# EAGLE board DAC STM32F446 Board SMD v7 (EAGLE 9.6.2)
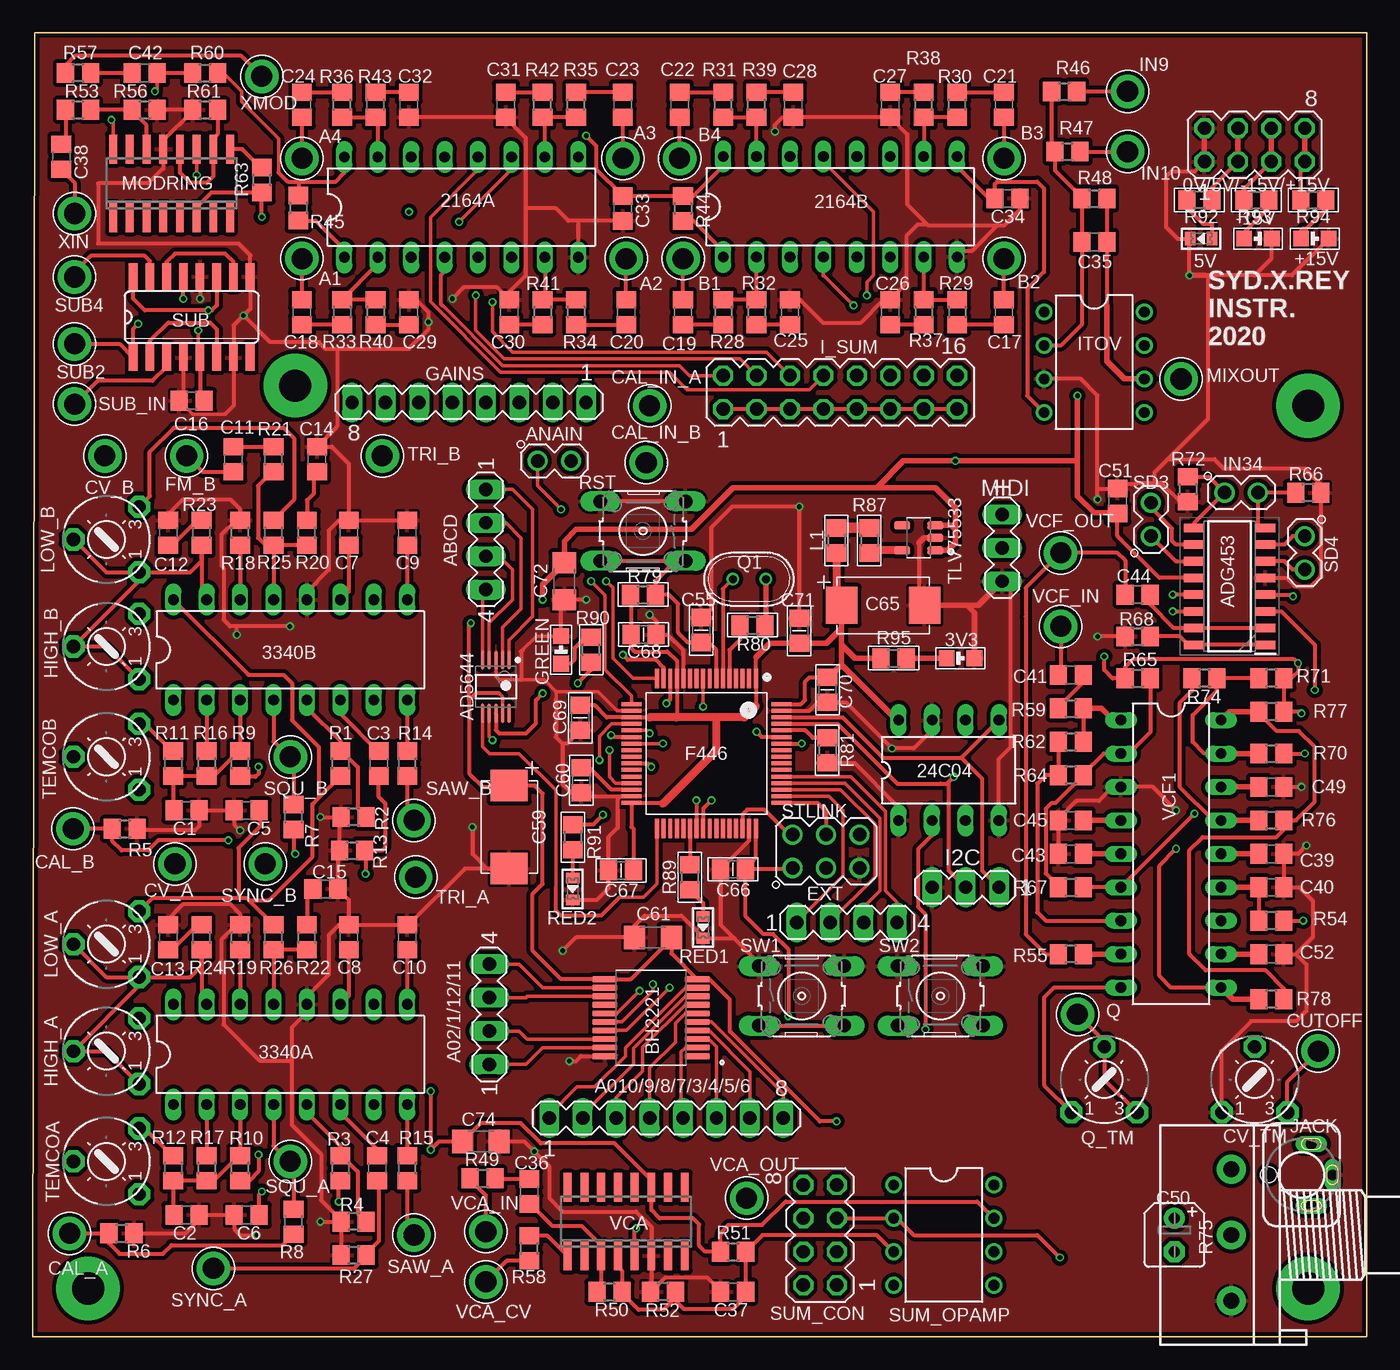
[diagram p5: board, top side]
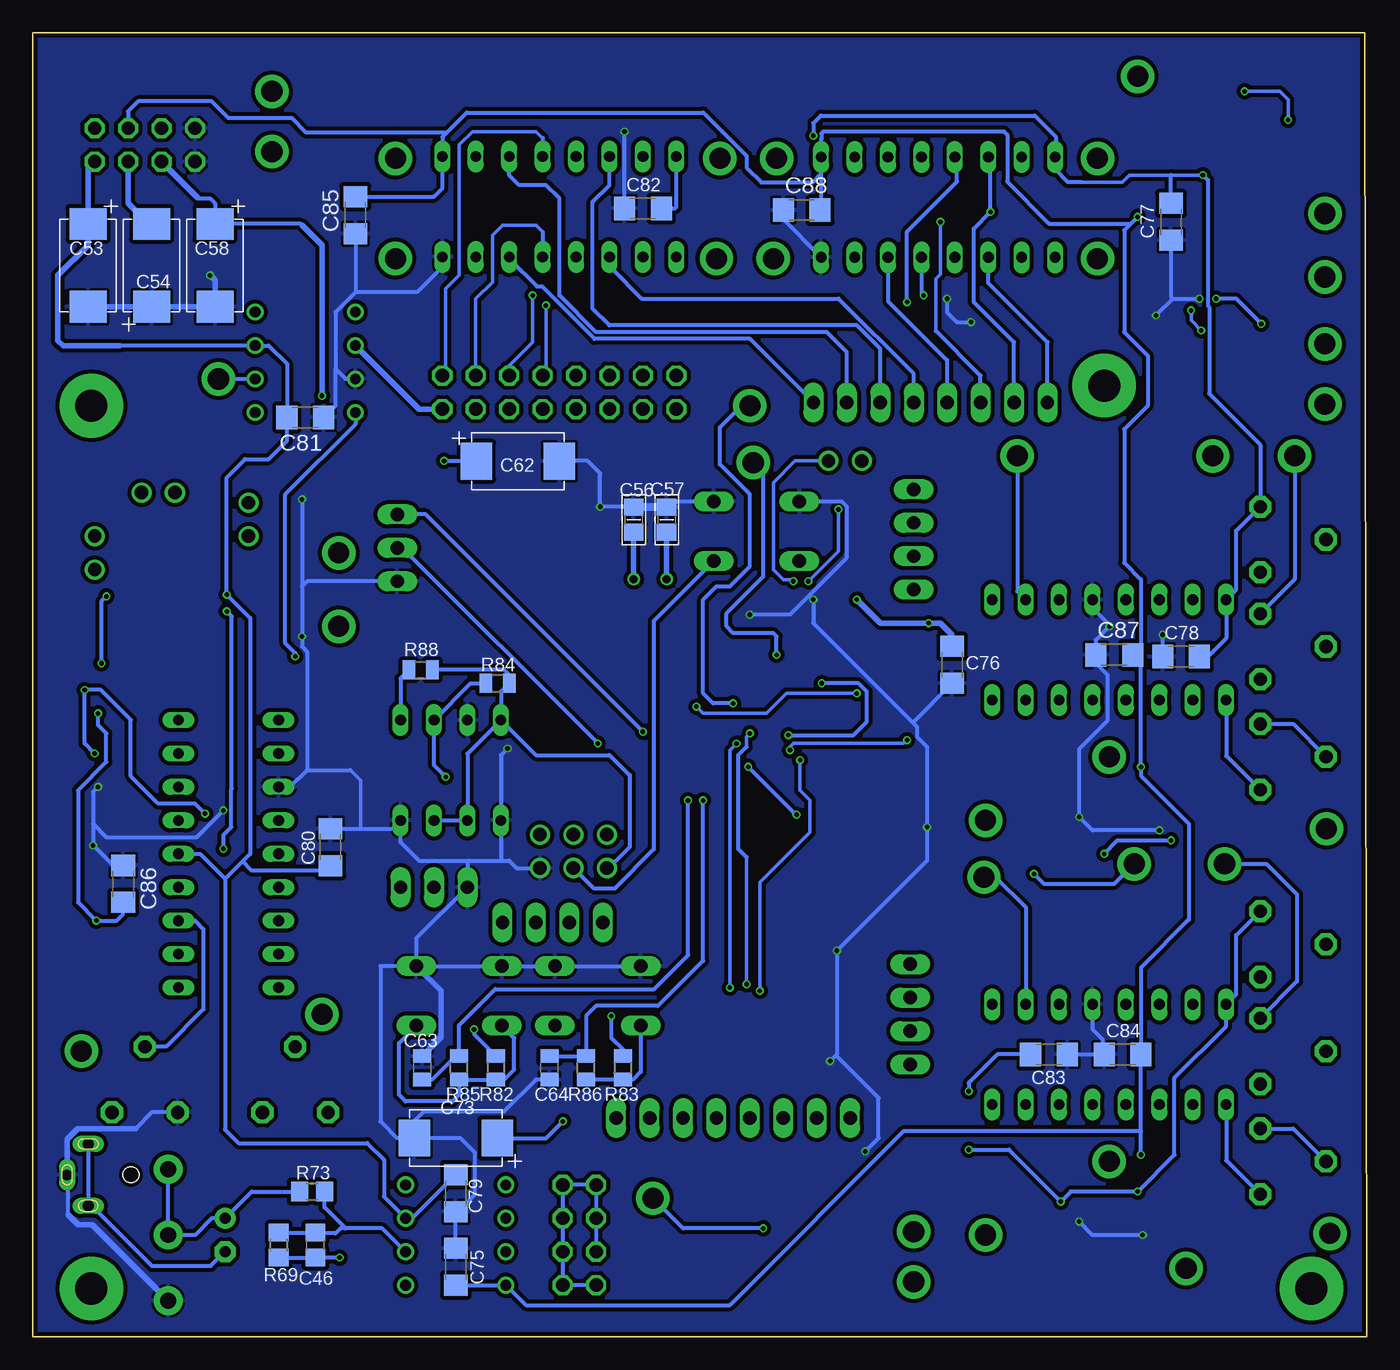
[diagram p6: board, bottom side, seen from below]

Size 101.35 x 99.06 mm. Coordinates in mm from the lower left corner, seen from the top.
Outline: 0,0 101.35,0 101.35,99.06 0.13,99.06 0,0
Copper layers (1*16): Top 0.018mm / dielectric 1.55mm / Bottom 0.018mm
Design rules "eC_2Layer_PClass6_BaseCopperO18_eCDefault": minimum track width 0.15mm, minimum drill 0.35mm, track to track 0.15mm, track to pad 0.15mm, pad to pad 0.15mm, via to via 0.15mm, smd to smd 0mil, copper to edge 0.25mm, drill to drill 0.35mm, minimum pad ring 0.175mm, minimum via ring 0.125mm, stop-mask expansion 0mil, vias tented up to drill 0.45mm, thermal gap 0.2mm

## Footprints (pad centres in the part's own frame; a part is rotated, then mirrored left to right if it is on the bottom)
MA04-2 = drill 1.016 octagon: 1 -3.81,-1.27; 2 -3.81,1.27; 3 -1.27,-1.27; 4 -1.27,1.27; 5 1.27,-1.27; 6 1.27,1.27; 7 3.81,-1.27; 8 3.81,1.27
0805-LED = smd 1.2 x 1.2: A -1.05,0; C 1.05,0
0603-LED = smd 0.8 x 1: A 0.825,0; C -0.825,0
DIL8 = drill 0.813 long: 1 -3.81,-3.81; 2 -1.27,-3.81; 3 1.27,-3.81; 4 3.81,-3.81; 5 3.81,3.81; 6 1.27,3.81; 7 -1.27,3.81; 8 -3.81,3.81
DIL16 = drill 0.813 long: 1 -8.89,-3.81; 2 -6.35,-3.81; 3 -3.81,-3.81; 4 -1.27,-3.81; 5 1.27,-3.81; 6 3.81,-3.81; 7 6.35,-3.81; 8 8.89,-3.81; 9 8.89,3.81; 10 6.35,3.81; 11 3.81,3.81; 12 1.27,3.81; 13 -1.27,3.81; 14 -3.81,3.81; 15 -6.35,3.81; 16 -8.89,3.81
TESTPOINT_63 = drill 1.6 pad 2.54: P$1 0,0
MA04-1 = drill 1.016 long: 1 -3.81,0; 2 -1.27,0; 3 1.27,0; 4 3.81,0
MA08-1 = drill 1.016 long: 1 -8.89,0; 2 -6.35,0; 3 -3.81,0; 4 -1.27,0; 5 1.27,0; 6 3.81,0; 7 6.35,0; 8 8.89,0
ANALOG_DEVICES_AD5644RBRMZ-5_0 = smd 1.45 x 0.25: 1 -2.025,1; 2 -2.025,0.5; 3 -2.025,0; 4 -2.025,-0.5; 5 -2.025,-1; 6 2.025,-1; 7 2.025,-0.5; 8 2.025,0; 9 2.025,0.5; 10 2.025,1
SOIC127P600X175-16N = smd 1.525 x 0.65: 1 -2.712,4.445; 2 -2.712,3.175; 3 -2.712,1.905; 4 -2.712,0.635; 5 -2.712,-0.635; 6 -2.712,-1.905; 7 -2.712,-3.175; 8 -2.712,-4.445; 9 2.712,-4.445; 10 2.712,-3.175; 11 2.712,-1.905; 12 2.712,-0.635; 13 2.712,0.635; 14 2.712,1.905; 15 2.712,3.175; 16 2.712,4.445
MA02-1 = drill 1.016: 1 -2.54,0; 2 0,0
SOP65P780X200-20N = smd 1.9 x 0.48: 1 -3.505,2.925; 2 -3.505,2.275; 3 -3.505,1.625; 4 -3.505,0.975; 5 -3.505,0.325; 6 -3.505,-0.325; 7 -3.505,-0.975; 8 -3.505,-1.625; 9 -3.505,-2.275; 10 -3.505,-2.925; 11 3.505,-2.925; 12 3.505,-2.275; 13 3.505,-1.625; 14 3.505,-0.975; 15 3.505,-0.325; 16 3.505,0.325; 17 3.505,0.975; 18 3.505,1.625; 19 3.505,2.275; 20 3.505,2.925
C0805 = smd 1.3 x 1.5: 1 -0.95,0; 2 0.95,0
B45181A = drill 0.813 pad 1.6: + -1.27,0 | drill 0.813 pad 1.6 octagon: - 1.27,0
CPOL2917 = smd 2.4 x 2.8: + -3.15,0; - 3.15,0
C1206 = smd 1.6 x 1.8: 1 -1.4,0; 2 1.4,0
C0805' = smd 1.016 x 1.422: 1 -0.889,0; 2 0.889,0
6MM = drill 1 pad 1.676 octagon: A -2.5,-2.5; E 2.5,-2.5; S 0,2.5
QFP50P1200X1200X160-64N = smd 1.5 x 0.3: 1 -5.7,3.75; 2 -5.7,3.25; 3 -5.7,2.75; 4 -5.7,2.25; 5 -5.7,1.75; 6 -5.7,1.25; 7 -5.7,0.75; 8 -5.7,0.25; 9 -5.7,-0.25; 10 -5.7,-0.75; 11 -5.7,-1.25; 12 -5.7,-1.75; 13 -5.7,-2.25; 14 -5.7,-2.75; 15 -5.7,-3.25; 16 -5.7,-3.75; 33 5.7,-3.75; 34 5.7,-3.25; 35 5.7,-2.75; 36 5.7,-2.25; 37 5.7,-1.75; 38 5.7,-1.25; 39 5.7,-0.75; 40 5.7,-0.25; 41 5.7,0.25; 42 5.7,0.75; 43 5.7,1.25; 44 5.7,1.75; 45 5.7,2.25; 46 5.7,2.75; 47 5.7,3.25; 48 5.7,3.75 | smd 0.3 x 1.5: 17 -3.75,-5.7; 18 -3.25,-5.7; 19 -2.75,-5.7; 20 -2.25,-5.7; 21 -1.75,-5.7; 22 -1.25,-5.7; 23 -0.75,-5.7; 24 -0.25,-5.7; 25 0.25,-5.7; 26 0.75,-5.7; 27 1.25,-5.7; 28 1.75,-5.7; 29 2.25,-5.7; 30 2.75,-5.7; 31 3.25,-5.7; 32 3.75,-5.7; 49 3.75,5.7; 50 3.25,5.7; 51 2.75,5.7; 52 2.25,5.7; 53 1.75,5.7; 54 1.25,5.7; 55 0.75,5.7; 56 0.25,5.7; 57 -0.25,5.7; 58 -0.75,5.7; 59 -1.25,5.7; 60 -1.75,5.7; 61 -2.25,5.7; 62 -2.75,5.7; 63 -3.25,5.7; 64 -3.75,5.7
HOLES_096-PAD-NS = drill 2.438 pad 4.826: B096 0,0
MA03-1 = drill 1.016 long: 1 -2.54,0; 2 0,0; 3 2.54,0
MA08-2 = drill 1.016 octagon: 1 -8.89,-1.27; 2 -8.89,1.27; 3 -6.35,-1.27; 4 -6.35,1.27; 5 -3.81,-1.27; 6 -3.81,1.27; 7 -1.27,-1.27; 8 -1.27,1.27; 9 1.27,-1.27; 10 1.27,1.27; 11 3.81,-1.27; 12 3.81,1.27; 13 6.35,-1.27; 14 6.35,1.27; 15 8.89,-1.27; 16 8.89,1.27
DIL08 = drill 0.813 pad 1.27: 1 -3.81,-3.81; 2 -1.27,-3.81; 3 1.27,-3.81; 4 3.81,-3.81; 5 3.81,3.81; 6 1.27,3.81; 7 -1.27,3.81; 8 -3.81,3.81
1502_01 = drill 0.8 pad 1.2 long: 1 0,2.35; 2 -2.35,0.75; 3 2.35,0.75 | hole 1.2: 0,-2.5
L0805 = smd 1.3 x 1.5: 1 -0.95,0; 2 0.95,0
SO16 = smd 0.6 x 2.2: 1 -4.445,-2.6; 2 -3.175,-2.6; 3 -1.905,-2.6; 4 -0.635,-2.6; 5 0.635,-2.6; 6 1.905,-2.6; 7 3.175,-2.6; 8 4.445,-2.6; 9 4.445,2.6; 10 3.175,2.6; 11 1.905,2.6; 12 0.635,2.6; 13 -0.635,2.6; 14 -1.905,2.6; 15 -3.175,2.6; 16 -4.445,2.6
Q-HC-46X = drill 0.61: 1 -1.25,0; 2 1.25,0
R0805 = smd 1.3 x 1.5: 1 -0.95,0; 2 0.95,0
3RP/1610N = drill 1.2 pad 2.184: 1 -5,0; 2 0,0; 3 5,0
R0805' = smd 1.016 x 1.422: 1 -0.889,0; 2 0.889,0
B3F-10XX = drill 1.016 long: 1 -3.251,2.261; 2 3.251,2.261; 3 -3.251,-2.261; 4 3.251,-2.261
MA03-2 = drill 1.016: 1 -2.54,-1.27; 2 -2.54,1.27; 3 0,-1.27; 4 0,1.27; 5 2.54,-1.27; 6 2.54,1.27
SO16' = smd 0.66 x 2.032: 1 -4.445,-3.073; 2 -3.175,-3.073; 3 -1.905,-3.073; 4 -0.635,-3.073; 5 0.635,-3.073; 6 1.905,-3.073; 7 3.175,-3.073; 8 4.445,-3.073; 9 4.445,3.073; 10 3.175,3.073; 11 1.905,3.073; 12 0.635,3.073; 13 -0.635,3.073; 14 -1.905,3.073; 15 -3.175,3.073; 16 -4.445,3.073
SOT95P280X145-5N = smd 1.21 x 0.59: 1 -1.255,0.95; 2 -1.255,0; 3 -1.255,-0.95; 4 1.255,-0.95; 5 1.255,0.95
DIL18 = drill 0.813 long: 1 -10.16,-3.81; 2 -7.62,-3.81; 3 -5.08,-3.81; 4 -2.54,-3.81; 5 0,-3.81; 6 2.54,-3.81; 7 5.08,-3.81; 8 7.62,-3.81; 9 10.16,-3.81; 10 10.16,3.81; 11 7.62,3.81; 12 5.08,3.81; 13 2.54,3.81; 14 0,3.81; 15 -2.54,3.81; 16 -5.08,3.81; 17 -7.62,3.81; 18 -10.16,3.81

## Placement (x,y rotation side)
0V/5V/-15V/+15V  [MA04-2]  92.84,90.55 0 top
3V3  [0805-LED]  70.48,51.56 0 top
5V  [0603-LED]  88.77,83.44 0 top
24C04  24C04AP  [DIL8]  69.6,43.05 0 top
2164A  SSM2164  [DIL16]  32.56,85.82 0 top
2164B  SSM2164  [DIL16]  61.34,85.85 0 top
3340A  CEM3340  [DIL16]  19.56,21.46 0 top
3340B  CEM3340  [DIL16]  19.56,52.2 0 top
+15V  [0805-LED]  97.41,83.44 0 top
-15V  [0805-LED]  93.09,83.44 180 top
A1  T  [TESTPOINT_63]  20.45,81.92 0 top
A2  T  [TESTPOINT_63]  45.09,81.92 0 top
A02/1/12/11  [MA04-1]  34.67,24.51 90 top
A3  T  [TESTPOINT_63]  44.83,89.54 0 top
A4  T  [TESTPOINT_63]  20.45,89.54 0 top
A010/9/8/7/3/4/5/6  [MA08-1]  48.13,16.64 0 top
ABCD  [MA04-1]  34.42,60.58 270 top
AD5644  ANALOG_DEVICES_AD5644RBRMZ-5ANALOG_DEVICES_AD5644RBRMZ-5_0_0  [ANALOG_DEVICES_AD5644RBRMZ-5_0]  35.18,49.4 270 top
ADG453  ADG453BRZ  [SOIC127P600X175-16N]  90.93,57.02 180 top
ANAIN  [MA02-1]  40.89,66.55 0 top
B1  T  [TESTPOINT_63]  49.4,81.92 0 top
B2  T  [TESTPOINT_63]  73.79,81.92 0 top
B3  T  [TESTPOINT_63]  73.79,89.54 0 top
B4  T  [TESTPOINT_63]  49.15,89.54 0 top
BH2221  BH2221FV  [SOP65P780X200-20N]  46.96,24.26 180 top
C1  100n  [C0805]  11.68,40 180 top
C2  100n  [C0805]  11.68,9.27 180 top
C3  1n  [C0805]  26.29,43.56 90 top
C4  1n  [C0805]  26.16,12.83 90 top
C5  100n  [C0805]  16.26,40 0 top
C6  100n  [C0805]  16.26,9.27 0 top
C7  1n  [C0805]  24,61.09 270 top
C8  1n  [C0805]  24,30.35 270 top
C9  100n  [C0805]  28.45,61.09 270 top
C10  100n  [C0805]  28.45,30.35 270 top
C11  100n  [C0805]  15.24,66.68 270 top
C12  10n  [C0805]  10.29,61.09 270 top
C13  10n  [C0805]  10.29,30.35 270 top
C14  10n  [C0805]  21.59,66.68 90 top
C15  10n  [C0805]  22.22,34.04 0 top
C16  100n  [C0805]  12.07,71.12 180 top
C17  470n  [C0805]  73.79,77.85 270 top
C18  470n  [C0805]  20.45,77.85 270 top
C19  470n  [C0805]  49.4,77.85 270 top
C20  470n  [C0805]  45.09,77.85 270 top
C21  470n  [C0805]  73.79,93.6 90 top
C22  470n  [C0805]  49.15,93.6 90 top
C23  470n  [C0805]  44.83,93.6 90 top
C24  470n  [C0805]  20.45,93.6 90 top
C25  560p  [C0805]  57.53,77.85 270 top
C26  560p  [C0805]  65.15,77.85 270 top
C27  560p  [C0805]  65.15,93.6 90 top
C28  560p  [C0805]  57.79,93.6 90 top
C29  560p  [C0805]  28.57,77.85 270 top
C30  560p  [C0805]  36.2,77.85 270 top
C31  560p  [C0805]  35.94,93.6 90 top
C32  560p  [C0805]  28.57,93.6 90 top
C33  100n  [C0805]  44.83,85.73 90 top
C34  100n  [C0805]  74.04,86.49 0 top
C35  100p  [C0805]  80.64,83.19 0 top
C36  4.7u  [C0805]  37.72,11.05 90 top
C37  4.7u  [C0805]  53.21,3.43 180 top
C38  4.7u  [C0805]  2.16,89.66 270 top
C39  100n  [C0805]  94.11,36.7 180 top
C40  100n  [C0805]  94.11,34.16 0 top
C41  470n  [C0805]  78.87,50.29 180 top
C42  1u  [C0805]  8.51,96.01 180 top
C43  300p  [C0805]  78.87,36.7 0 top
C44  1u  [C0805]  83.95,56.39 180 top
C45  300p  [C0805]  78.87,39.24 0 top
C46  100p  [C0805]  79.88,6.99 270 bottom
C49  300p  [C0805]  94.11,41.78 180 top
C50  22u  [B45181A]  86.74,7.75 270 top
C51  100n  [C0805]  82.42,63.5 90 top
C52  300p  [C0805]  94.11,29.08 180 top
C53  10u  [CPOL2917]  97.16,81.41 270 bottom
C54  10u  [CPOL2917]  92.33,81.41 90 bottom
C55  0.1uF  [C0805]  50.78,53.7 270 top
C56  12pF  [C0805]  55.69,62.07 270 bottom
C57  12pF  [C0805]  53.19,62.07 270 bottom
C58  10u  [CPOL2917]  87.5,81.41 270 bottom
C59  10u  [CPOL2917]  36.2,38.73 270 top
C60  2.2uF  [C0805]  41.68,42.3 90 top
C61  100n  [C1206]  47.12,30.35 0 top
C62  10u  [CPOL2917]  64.48,66.52 0 bottom
C63  100n  [C0805']  71.75,20.45 90 bottom
C64  100n  [C0805']  62.1,20.45 270 bottom
C65  100 uF  [CPOL2917]  64.61,55.57 0 top
C66  0.1uF  [C0805]  53.2,35.53 0 top
C67  0.1uF  [C0805]  44.69,35.45 0 top
C68  0.1uF  [C0805]  46.4,53.36 180 top
C69  0.1uF  [C0805]  41.6,47.02 90 top
C70  0.1uF  [C0805]  60.38,49.16 90 top
C71  1.0uF  [C0805]  58.24,53.64 270 top
C72  100n  [C1206]  40.39,57.4 90 top
C73  10u  [CPOL2917]  69.21,15.11 180 bottom
C74  1u  [C1206]  34.04,14.86 180 top
C75  1u  [C1206]  69.21,5.33 270 bottom
C76  1u  [C1206]  31.5,51.05 90 bottom
C77  1u  [C1206]  14.86,84.71 90 bottom
C78  1u  [C1206]  14.1,51.69 0 bottom
C79  1u  [C1206]  69.21,10.92 90 bottom
C80  1u  [C1206]  78.74,37.21 270 bottom
C81  1u  [C1206]  80.64,69.85 180 bottom
C82  1u  [C1206]  54.99,85.73 0 bottom
C83  1u  [C1206]  24.13,21.46 180 bottom
C84  1u  [C1206]  18.54,21.46 0 bottom
C85  1u  [C1206]  76.83,85.22 90 bottom
C86  1u  [C1206]  94.49,34.42 270 bottom
C87  1u  [C1206]  19.18,51.82 0 bottom
C88  1u  [C1206]  42.93,85.6 0 bottom
CAL_A  SYNC_IN  [TESTPOINT_63]  2.79,7.87 90 top
CAL_B  CALIB B  [TESTPOINT_63]  3.05,38.61 90 top
CAL_IN_A  [TESTPOINT_63]  46.86,70.74 0 top
CAL_IN_B  [TESTPOINT_63]  46.61,66.42 0 top
CUTOFF  [TESTPOINT_63]  97.66,21.72 0 top
CV_A  CV  [TESTPOINT_63]  10.79,35.94 90 top
CV_B  CV  [TESTPOINT_63]  5.46,66.93 90 top
CV_TM  100k  [6MM]  92.84,19.56 0 top
EXT  [MA04-1]  61.85,31.5 0 top
F446  STM32F446RCT7  [QFP50P1200X1200X160-64N]  51.18,44.32 270 top
FM_B  FMLIN  [TESTPOINT_63]  11.68,66.93 90 top
GAINS  GAIN_CTRL  [MA08-1]  33.15,70.99 180 top
GREEN  [0805-LED]  40.13,52.2 90 top
HIGH_A  100k  [6MM]  5.59,21.72 90 top
HIGH_B  100k  [6MM]  5.59,52.45 90 top
HOLE1  HOLES_MOUNT-PAD-ROUND-0.096-NS  [HOLES_096-PAD-NS]  96.9,70.74 0 top
HOLE2  HOLES_MOUNT-PAD-ROUND-0.096-NS  [HOLES_096-PAD-NS]  4.19,3.68 0 top
HOLE3  HOLES_MOUNT-PAD-ROUND-0.096-NS  [HOLES_096-PAD-NS]  96.9,3.68 0 top
HOLE4  HOLES_MOUNT-PAD-ROUND-0.096-NS  [HOLES_096-PAD-NS]  19.94,72.26 0 top
I2C  [MA03-1]  70.87,34.16 180 top
I_SUM  ITOV  [MA08-2]  61.34,71.76 0 top
IN9  [TESTPOINT_63]  83.19,94.62 0 top
IN10  [TESTPOINT_63]  83.19,90.04 0 top
IN34  IN34  [MA02-1]  93.09,64.14 0 top
ITOV  NE5534AN  [DIL08]  80.64,74.04 270 top
JACK  1502_01  [1502_01]  96.39,12.32 270 top
L1  1 uH  [L0805]  61.06,60.5 270 top
LOW_A  100k  [6MM]  5.59,29.85 90 top
LOW_B  100k  [6MM]  5.59,60.58 90 top
MIDI  [MA03-1]  73.66,59.94 270 top
MIXOUT  [TESTPOINT_63]  87.25,72.77 0 top
MODRING  LM13700M  [SO16]  10.54,87.63 0 top
Q  [TESTPOINT_63]  79.38,24.51 0 top
Q1  16MHz  [Q-HC-46X]  54.44,57.57 180 top
Q_TM  100k  [6MM]  81.41,19.56 0 top
R1  330k  [R0805]  23.37,43.56 270 top
R2  68k  [R0805]  24.38,39.5 180 top
R3  330k  [R0805]  23.37,12.83 270 top
R4  68k  [R0805]  24.38,8.76 180 top
R5  10k  [R0805]  6.98,38.61 0 top
R6  10k  [R0805]  6.73,7.87 0 top
R7  33k  [R0805]  19.81,39.5 90 top
R8  33k  [R0805]  19.81,8.76 90 top
R9  820  [R0805]  15.75,43.56 90 top
R10  820  [R0805]  15.75,12.83 90 top
R11  24k  [R0805]  10.67,43.56 270 top
R12  24k  [R0805]  10.67,12.83 270 top
R13  470k  [R0805]  24.26,36.96 0 top
R14  5.6k  [R0805]  28.45,43.56 90 top
R15  5.6k  [R0805]  28.45,12.83 90 top
R16  5.6k  [R0805]  13.21,43.56 270 top
R17  5.6k  [R0805]  13.21,12.83 270 top
R18  1.8k  [R0805]  15.75,61.09 90 top
R19  1.8k  [R0805]  15.75,30.35 90 top
R20  470  [R0805]  20.83,61.09 90 top
R21  1M  [R0805]  18.29,66.68 90 top
R22  470  [R0805]  20.83,30.35 90 top
R23  470  [R0805]  12.83,61.09 90 top
R24  470  [R0805]  12.83,30.35 90 top
R25  1.5M  [R0805]  18.29,61.09 90 top
R26  1.5M  [R0805]  18.29,30.35 90 top
R27  470k  [R0805]  24.38,6.22 0 top
R28  27k  [R0805]  52.45,77.85 270 top
R29  27k  [R0805]  70.23,77.85 270 top
R30  27k  [R0805]  70.23,93.6 90 top
R31  27k  [R0805]  52.45,93.6 90 top
R32  470  [R0805]  54.99,77.85 270 top
R33  27k  [R0805]  23.49,77.85 270 top
R34  27k  [R0805]  41.28,77.85 270 top
R35  27k  [R0805]  41.28,93.6 90 top
R36  27k  [R0805]  23.49,93.6 90 top
R37  470  [R0805]  67.69,77.85 270 top
R38  470  [R0805]  67.69,93.6 90 top
R39  470  [R0805]  54.99,93.6 90 top
R40  470  [R0805]  26.04,77.85 270 top
R41  470  [R0805]  38.73,77.85 270 top
R42  470  [R0805]  38.73,93.6 90 top
R43  470  [R0805]  26.04,93.6 90 top
R44  8.2k  [R0805]  49.4,85.73 270 top
R45  8.2k  [R0805]  20.18,85.76 270 top
R46  27k  [R0805]  78.36,94.62 0 top
R47  27k  [R0805]  78.61,90.04 0 top
R48  33K  [R0805]  80.64,86.49 0 top
R49  100k  [R0805]  34.16,12.06 0 top
R50  1k  [R0805]  43.82,3.43 0 top
R51  10k  [R0805]  53.21,6.48 0 top
R52  10k  [R0805]  47.88,3.43 180 top
R53  100k  [R0805]  3.43,93.22 0 top
R54  1.5k  [R0805]  94.11,31.62 180 top
R55  51k  [R0805]  78.87,29.08 180 top
R56  1k  [R0805]  8.51,93.22 0 top
R57  4.7k  [R0805]  3.43,96.01 180 top
R58  27k  [R0805]  37.72,6.73 90 top
R59  91k  [R0805]  78.87,47.75 0 top
R60  47k  [R0805]  13.08,96.01 0 top
R61  22k  [R0805]  13.08,93.22 0 top
R62  100k  [R0805]  78.87,45.21 0 top
R63  10k  [R0805]  17.4,87.88 90 top
R64  91k  [R0805]  78.87,42.67 180 top
R65  220k  [R0805]  83.95,50.04 0 top
R66  100k  [R0805]  96.9,64.14 180 top
R67  100k  [R0805]  78.87,34.16 0 top
R68  100k  [R0805]  83.95,53.21 0 top
R69  47k  [R0805]  82.68,6.99 270 bottom
R70  91k  [R0805]  94.11,44.32 0 top
R71  220k  [R0805]  94.11,50.04 180 top
R72  100k  [R0805]  87.76,64.39 270 top
R73  470  [R0805]  80.14,11.05 0 bottom
R74  100k  [R0805]  89.03,50.04 180 top
R75  100kB  [3RP/1610N]  91.06,7.75 90 top
R76  91k  [R0805]  94.11,39.24 180 top
R77  220k  [R0805]  94.11,47.5 180 top
R78  100k  [R0805]  94.11,25.65 180 top
R79  100k  [R0805]  46.36,56.39 0 top
R80  100  [R0805]  54.69,54.07 0 top
R81  10K  [R0805]  60.37,44.57 270 top
R82  10k  [R0805']  66.17,20.45 270 bottom
R83  10k  [R0805']  56.52,20.45 270 bottom
R84  1k  [R0805']  66.04,49.66 0 bottom
R85  10k  [R0805']  68.96,20.45 90 bottom
R86  10k  [R0805']  59.31,20.45 90 bottom
R87  1  [R0805]  63.56,60.5 270 top
R88  1k  [R0805']  71.88,50.67 0 bottom
R89  180  [R0805]  49.91,34.92 270 top
R90  1k  [R0805]  42.42,52.2 90 top
R91  180  [R0805]  41.02,37.97 270 top
R92  470  [R0805]  88.65,86.36 180 top
R93  10k  [R0805]  92.96,86.36 0 top
R94  10k  [R0805]  97.28,86.36 0 top
R95  1k  [R0805]  65.41,51.56 0 top
RED1  [0603-LED]  50.93,31.12 90 top
RED2  [0603-LED]  41.02,34.04 90 top
RST  [B3F-10XX]  46.36,61.21 180 top
SAW_A  S  [TESTPOINT_63]  28.96,7.75 270 top
SAW_B  S  [TESTPOINT_63]  28.96,39.24 270 top
SD3  SD3  [MA02-1]  84.96,63.37 90 top
SD4  SD4  [MA02-1]  96.65,58.29 270 top
SQU_A  P  [TESTPOINT_63]  19.56,13.33 270 top
SQU_B  P  [TESTPOINT_63]  19.56,44.07 270 top
STLINK  75867-331LF  [MA03-2]  60.27,36.89 0 top
SUB  4027D  [SO16']  12.07,77.47 0 top
SUB2  T  [TESTPOINT_63]  3.17,75.44 90 top
SUB4  T  [TESTPOINT_63]  3.17,80.52 90 top
SUB_IN  T  [TESTPOINT_63]  3.17,70.87 90 top
SUM_CON  [MA04-2]  59.82,7.75 90 top
SUM_OPAMP  NE5534AN  [DIL08]  69.21,7.75 270 top
SW1  [B3F-10XX]  58.42,25.91 0 top
SW2  [B3F-10XX]  68.96,25.91 0 top
SYNC_A  SYNC_IN  [TESTPOINT_63]  13.72,5.21 180 top
SYNC_B  SYNC_IN  [TESTPOINT_63]  17.65,35.94 90 top
TEMCOA  10k  [6MM]  5.59,13.33 90 top
TEMCOB  10k  [6MM]  5.59,44.07 90 top
TLV75533  TLV75533PDBVR  [SOT95P280X145-5N]  67.31,60.71 180 top
TRI_A  T  [TESTPOINT_63]  29.08,34.92 180 top
TRI_B  T  [TESTPOINT_63]  26.54,66.93 180 top
VCA  LM13700M  [SO16]  45.09,8.76 0 top
VCA_CV  [TESTPOINT_63]  34.42,4.19 0 top
VCA_IN  [TESTPOINT_63]  34.42,8 0 top
VCA_OUT  [TESTPOINT_63]  54.23,10.54 0 top
VCF1  AS3320  [DIL18]  86.49,36.7 270 top
VCF_IN  [TESTPOINT_63]  78.1,53.97 0 top
VCF_OUT  [TESTPOINT_63]  78.1,59.56 0 top
XIN  [TESTPOINT_63]  3.17,85.34 0 top
XMOD  [TESTPOINT_63]  17.4,95.76 0 top

## Tracks (layer width: path | path; a pad name or v marks a point on that pad's centre or on a via)
3V3  (via drill 0.35)
  Top 0.305: 54.93,47.92 F446.1 54.93,51.63 | F446.64 58.36,48.07 58.67,48.39 58.67,49.78 59,50.11 C70.2 60.48,50.11 | R79.1 45.45,56.34 C68.2 45.45,52.34 45.72,52.07 48.22,52.07 48.93,51.36 F446.13 48.93,47.1 48.9,47.07 | F446.32 | C66.2 54.15,35.63 54.93,36.4 F446.48 | C69.2 42.7,47.97 43.61,47.07 F446.19 46.86,47.07 | 61.46,51.09 61.45,51.08 | STLINK.1 57.64,35.53 C66.2 | v57.4,24.38 57.4,29.46 56.25,30.61 55.5,30.61 54.15,31.95 C66.2 | F446.32 47.82,40.57 47.88,40.51 | C67.2 45.64,38.59 45.48,38.75 F446.32 | 24C04.2 68.33,38.1 67.26,37.04 67.26,32.69 67.82,32.13 v67.82,23.37 | C65.+ 61.46,53.84
  Top 0.406: 54.93,51.63 55.99,52.69 C71.2 60.31,52.69 61.46,53.84 | C65.+ 61.46,52.58 | 61.46,52.58 61.46,51.09 | 60.48,50.11 61.45,51.08 65.66,46.86 24C04.8 | R95.1 62.47,51.56 61.46,52.58
  Top 0.61: 54.93,47.92 54.07,47.07 51.94,47.07 | 51.94,47.07 48.9,47.07 46.86,47.07 | L1.2 61.06,55.97 C65.+ | 51.94,47.07 51.94,44.58 47.88,40.51
  Bottom 0.305: 24C04.8 65.79,49.02 R84.2 65.15,50.29 65.53,50.67 R88.2 | 24C04.8 68.33,44.32 24C04.2 24C04.3 | v57.4,24.38 57.4,22.73 56.52,21.84 R83.1 | v67.82,23.37 67.82,22.99 R82.1 | STLINK.1 57.59,35.62 56.01,37.21 56.01,42.67 57.53,44.2 63.12,44.2 24C04.8
5V  (via drill 0.35)
  Top 0.254: AD5644.9 35.68,48.65 35.43,48.89
  Top 0.305: 35.43,48.89 33.66,48.89 33.15,48.39 | 33.15,48.39 33.15,42.8 34.16,41.78 36.09,41.78 C59.+ 38.12,41.88 38.73,41.27 38.73,34.42 37.97,33.65 37.97,29.34 40.13,27.18 BH2221.11 45.45,27.18 48.52,30.25 C61.2 48.52,29.14 BH2221.10 51.4,27.18 52.96,25.62 52.96,23.22 59.8,16.38 v61.07,16.38 | ADG453.12 85.6,57.66 82.42,60.83 C51.1 82.36,62.61 | 33.15,48.39 33.15,54.1 v33.27,54.23 | R92.1 89.6,87.31 0V/5V/-15V/+15V.3
  Top 0.406: TLV75533.3 69.79,61.66 70.1,61.34 | 70.1,61.34 70.1,60.32 69.53,59.76 TLV75533.1 | 82.36,62.61 80.64,62.61 79.38,63.88 79.38,66.55 | 0V/5V/-15V/+15V.4 0V/5V/-15V/+15V.3 | 79.38,66.55 v79.38,71.5 | v38.73,56.01 38.73,57.15 C72.2 40.39,60.45 41.28,61.34 50.04,61.34 53.21,64.52 64.13,64.52 | 70.1,61.34 70.1,62.99 68.58,64.52 64.13,64.52 | 64.13,64.52 66.17,66.55 v70.1,66.55 79.38,66.55
  Bottom 0.305: C73.+ 62.34,15.11 v61.07,16.38 | C62.+ 70.07,66.52 v70.1,66.55 | 80.9,84.45 81,84.56 C58.+ 87.5,86.11 87.88,86.49 88.77,86.49 88.84,86.55
  Bottom 0.406: 80.9,84.45 79.38,82.93 v79.38,71.5 | v38.73,56.01 36.96,54.23 v33.27,54.23 32.39,54.23 31.5,53.34 C76.2 | 0V/5V/-15V/+15V.3 88.84,86.55
2164_IN1_MIXA
  Top 0.305: R40.1 R33.1 26.21,81.51 2164A.2
2164_IN2_MIXA
  Top 0.305: R34.1 R41.1 38.91,78.97 2164A.7
2164_IN2_MIXB
  Top 0.305: R29.1 R37.1 2164B.7
2164_IN3_MIXA
  Top 0.305: R35.1 R42.1 38.91,92.48 2164A.10
2164_IN3_MIXB
  Top 0.305: R30.1 R38.1 2164B.10
2164_IN4_MIXA
  Top 0.305: R36.1 R43.1 26.21,92.48 2164A.15
2164_IN4_MIXB
  Top 0.305: R31.1 R39.1 2164B.15
2164_IN4_MIXB1
  Top 0.305: R28.1 R32.1 2164B.2
2164_MODE_MIXB
  Top 0.305: R44.2 50.2,84.78 52.45,82.53 2164B.1
2164_OUT2_MIXA  (via drill 0.35)
  Top 0.254: I_SUM.4 53.72,74.3 35.82,74.3 33.66,76.46 v33.66,79.12
  Bottom 0.305: 2164A.5 33.83,79.29 v33.66,79.12
2164_OUT2_MIXB
  Bottom 0.254: I_SUM.14 67.69,78.87 66.42,80.14 66.42,83.69 65.66,84.45 63.12,84.45 62.61,83.95
  Bottom 0.305: 62.61,83.95 2164B.5
2164_OUT3_MIXA
  Top 0.254: 33.66,88.52 30.2,85.07 30.2,78.63 35.55,73.28 48.39,73.28 49.71,71.96 59.01,71.96 I_SUM.8
  Top 0.305: 2164A.12 33.83,88.69 33.66,88.52
2164_OUT3_MIXB
  Bottom 0.254: I_SUM.16 69.98,73.28 69.98,79.63 68.96,80.65 68.96,90.55 67.94,91.57 63.12,91.57 62.61,91.06
  Bottom 0.305: 62.61,91.06 2164B.12
2164_OUT4_MIXA  (via drill 0.35)
  Top 0.254: I_SUM.6 55.75,74.8 36.47,74.8 34.93,76.34 v34.93,78.61
  Bottom 0.305: v34.93,78.61 34.93,83.95 31.11,87.76 31.11,89.46 2164A.13
2164_OUT4_MIXB  (via drill 0.35)
  Top 0.254: v63.37,79.12 63.37,80.14 63.88,80.65 63.88,85.47 60.07,89.28
  Top 0.305: 2164B.13 60.07,89.28
  Bottom 0.254: I_SUM.12 65.15,73.79 63.37,75.56 v63.37,79.12
+15V  (via drill 0.35)
  Top 0.254: R60.2 14.48,96.01 15.85,94.64 15.85,93.85 18.67,91.03 18.67,88.45 | MODRING.11 v12.45,88.27
  Top 0.305: ADG453.13 v86.61,56.39 | LOW_B.E 8.89,63.88 8.89,67.25 10.73,69.09 19.04,69.09 19.85,68.27 19.85,63.6 R25.2 | LOW_A.E 9.09,33.35 15.62,33.35 | 15.62,33.35 16.24,33.35 16.41,33.18 | 16.41,33.18 R26.2 | v42.04,91.25 42.8,90.48 42.8,88.71 C33.2 R44.1 50.2,86.68 52.45,88.93 2164B.16 | SUM_OPAMP.7 71.75,10.29 57.19,10.29 55.41,8.51 52.87,8.51 52.28,7.91 52.26,7.73 R51.1 51.08,6.48 50.62,6.93 50.62,8.56 50.16,9.02 47.62,9.02 46.99,9.65 VCA.11 46.86,11.49 46.86,12.05 44.21,14.7 38.61,14.7 37.07,16.24 34.02,16.24 C74.2 30.86,14.86 v30.23,14.22 v30.23,18.67 | 21.75,40.99 21.24,40.48 21.24,36.48 17.94,33.18 16.41,33.18 | 21.75,40.99 R1.2 | C5.2 17.26,39.95 17.26,38.78 15.62,37.15 15.62,33.35 | 21.75,40.99 21.75,44.8 19.68,46.86 19.68,49.66 19.05,50.29 16.38,50.29 3340B.16 | C6.2 17.21,10.86 v17.4,11.05 | v23.24,10.29 23.24,11.75 R3.2 | 18.67,88.45 19.36,87.76 20.19,87.76 | 2164A.16 23.67,88.44 22.99,87.76 20.19,87.76 | 20.19,87.76 20.19,86.72 R45.1 | R94.1 96.33,88.97 0V/5V/-15V/+15V.7
  Top 0.406: C39.2 VCF1.14 | 0V/5V/-15V/+15V.8 0V/5V/-15V/+15V.7
  Bottom 0.254: v12.45,88.27 14.86,88.27 18.03,88.27 18.56,87.73 21.69,87.73
  Bottom 0.305: VCF1.14 88.65,36.7 86.74,34.8 | 85.41,36.13 84.84,36.7 84.84,54.61 v86.61,56.39 86.61,65.28 85.22,66.68 83.44,66.68 82.05,68.07 C81.2 82.05,73.92 83.44,75.31 ITOV.7 94.74,75.31 | 85.41,36.13 86.74,34.8 | LOW_A.E 9.91,30.53 9.91,26.04 3340A.16 10.67,23.62 14.61,19.69 14.61,13.84 v17.4,11.05 22.48,11.05 v23.24,10.29 27.18,14.22 v30.23,14.22 | v42.04,91.25 42.04,92.21 41.46,92.78 25.22,92.78 23.62,91.19 23.62,89.68 2164A.16 23.67,88.69 22.71,87.73 21.69,87.73 | 97.16,88.77 0V/5V/-15V/+15V.7 | v12.45,88.27 12.07,87.88 12.07,78.32 11.97,78.23 11.97,71.66 8.09,67.78 LOW_B.E 9.91,61.26 9.91,56.77 3340B.16 10.67,53.09 12.07,51.69 C78.2 | C77.2 14.86,88.27 | C79.2 72.52,9.02 SUM_OPAMP.7 74.68,10.67 74.68,13.46 75.95,14.73 85.72,14.73 86.74,15.75 86.74,34.8 | C80.2 79.12,35.43 84.71,35.43 85.41,36.13 | C82.2 52.58,85.73 52.45,85.85 2164B.16 | C83.2 28.07,21.46 30.23,19.3 v30.23,18.67
  Bottom 0.406: 97.16,88.77 C53.+ 97.16,82.93 99.44,80.65 99.44,75.69 99.06,75.31 94.74,75.31
-15V  (via drill 0.35)
  Top 0.305: R54.1 v96.52,31.62 | v96.39,47.37 96.27,47.5 R77.1 R71.1 95.06,50.14 95.73,50.14 96.14,50.55 v96.14,51.18 95.85,51.47 83.57,51.47 83,50.9 R65.1 82.04,50.04 81.41,50.67 v81.41,51.69 | ADG453.4 95.63,56.39 v95.76,56.26 | MODRING.6 12.45,85.83 13.55,86.93 R63.1 v17.4,85.09 | v17.14,43.31 17.14,42.8 16.89,42.54 15.81,42.54 R9.1 | v17.14,13.84 17.14,12.57 16.38,11.81 15.81,11.81 R10.1 | ITOV.4 75.56,71.5 75.56,79.63 76.83,80.9 76.83,87.25 76.33,87.76 73.28,87.76 73.09,87.57 C34.1 72.54,86.61 70.23,88.93 2164B.9 | R93.1 92.01,87.19 0V/5V/-15V/+15V.5
  Top 0.406: 0V/5V/-15V/+15V.6 0V/5V/-15V/+15V.5
  Bottom 0.305: v96.39,47.37 96.39,46.48 95.76,45.85 95.76,43.69 97.92,41.53 97.92,33.02 v96.52,31.62 95,31.62 94.49,32.13 C86.2 | v95.76,56.26 96.14,55.88 v96.14,51.18 | 69.9,91.49 70.23,91.16 2164B.9 70.23,87.25 70.86,86.62 C85.2 | 69.9,91.49 68.38,93.01 50.4,93.01 47.12,89.73 47.12,88.84 45.99,87.71 42.09,87.71 41.45,88.35 2164A.9 | 17.91,84.58 24.13,84.58 27.3,87.76 27.3,91.31 27.56,91.57 41.28,91.57 41.44,91.41 41.44,91 41.45,90.99 2164A.9 | v17.4,85.09 17.91,84.58 | 17.91,84.58 18.41,84.07 18.41,76.33 16.64,74.55 16.64,70.74 18.41,68.96 18.41,58.8 17.14,57.53 17.14,52.45 C87.2 17.14,51.18 v17.14,43.31 17.14,42.63 13.5,38.98 13.5,31.72 17.14,28.07 C84.2 | v17.14,13.84 17.14,15.62 | 17.14,15.62 35.18,15.62 48.39,2.41 63.88,2.41 SUM_OPAMP.4 C75.2 | v81.41,51.69 81.41,51.94 82.17,52.7 82.17,64.01 76.83,69.34 ITOV.4 | 69.9,91.49 80.57,91.49 81.66,92.58 86.49,92.58 87.76,93.85 93.34,93.85 94.11,93.09 0V/5V/-15V/+15V.6 | C84.2 | 17.14,15.62 C84.2 | 2164A.9 41.45,85.68 C88.2
  Bottom 0.406: C54.- 92.53,84.56 94.11,86.14 0V/5V/-15V/+15V.5
AD5644_CLK  (via drill 0.35)
  Top 0.254: AD5644.7 34.68,45.59 v34.93,45.34 | v43.82,44.58 43.82,42.54 44.29,42.07 F446.29
  Bottom 0.254: v34.93,45.34 35.18,45.09 43.56,45.09 43.82,44.83 v43.82,44.58
AD5644_DI  (via drill 0.35)
  Top 0.254: v50.93,47.88 F446.9
  Top 0.305: AD5644.8 35.18,46.1 35.43,45.85 37.47,45.85 38.23,46.61 38.23,48.39 v38.73,48.89
  Bottom 0.254: v38.73,48.89 41.28,48.89 44.07,48.89 45.59,47.37 50.42,47.37 v50.93,47.88
AD5644_SYNC
  Top 0.254: F446.33 47.43,34.42 46.41,33.4 44.58,33.4 | AD5644.6 34.18,44.83 34.69,44.32 36.96,44.32 39.75,41.53 39.75,34.16
  Top 0.305: 44.58,33.4 43.18,32 40.13,32 39.75,32.38 39.75,34.16
BH2221_AO1
  Top 0.254: BH2221.18 37.57,22.63 36.96,23.24 A02/1/12/11.2
BH2221_AO2
  Top 0.254: BH2221.19 38.75,21.98 37.47,20.7 A02/1/12/11.1
BH2221_AO3
  Top 0.254: A010/9/8/7/3/4/5/6.5 49.4,16.89 49.24,17.05 49.24,21.65 49.57,21.98 BH2221.2
BH2221_AO4
  Top 0.254: BH2221.3 51.37,22.63 51.94,22.05 A010/9/8/7/3/4/5/6.6
BH2221_AO6
  Top 0.254: BH2221.5 51.56,23.93 57.02,18.47 A010/9/8/7/3/4/5/6.8
BH2221_AO7
  Top 0.254: BH2221.6 49.57,24.58 48.82,23.83 48.82,22.4 46.86,20.45 A010/9/8/7/3/4/5/6.4
BH2221_AO8
  Top 0.254: BH2221.7 49.57,25.23 46.33,21.99 46.33,20.17 44.32,18.16 A010/9/8/7/3/4/5/6.3
BH2221_AO9
  Top 0.254: BH2221.8 49.57,25.88 45.63,21.94 45.63,20.73 41.78,16.89 A010/9/8/7/3/4/5/6.2
BH2221_AO10
  Top 0.254: BH2221.9 49.57,26.53 45.02,21.98 45.02,21.34 42.68,19.01 41.36,19.01 39.24,16.89 A010/9/8/7/3/4/5/6.1
BH2221_AO11
  Top 0.254: BH2221.12 38.75,26.53 36.96,28.32 A02/1/12/11.4
BH2221_AO12
  Top 0.254: BH2221.13 37.57,25.88 37.47,25.78 A02/1/12/11.3
BH2221_CLK  (via drill 0.35)
  Top 0.254: BH2221.16 44.76,23.93 47.12,26.29 v47.12,26.8 | v46.86,45.85 46.64,46.07 F446.21
  Bottom 0.254: v46.86,45.85 47.12,45.59 47.12,44.83 | 47.12,36.45 v47.12,26.8
  Bottom 0.305: 47.12,44.83 47.75,44.2 47.75,37.08 47.12,36.45
BH2221_DI  (via drill 0.35)
  Top 0.254: BH2221.17 45.13,23.28 v48.39,26.54 | v47.88,45.09 v47.87,45.07 F446.23
  Bottom 0.254: v47.88,45.09 48.39,44.58 v48.39,26.54
BH2221_LD  (via drill 0.35)
  Top 0.254: BH2221.15 44.39,24.58 v46.1,26.29 | F446.20 43.98,46.57 43.05,45.65 v43.05,43.81
  Bottom 0.254: v43.05,43.81 43.05,41.53 42.29,40.77 42.29,38.35 46.1,34.54 v46.1,26.29
BIAS_VCA
  Top 0.305: 48.73,2.87 49.48,2.12 53.21,2.12 54.06,2.97 C37.1 R51.2 55.43,7.75 64.13,7.75 SUM_OPAMP.3 | R52.1 48.73,3.38 48.98,3.12 48.73,2.87 | 48.73,2.87 47.93,2.07 46.03,2.07 44.77,3.33 R50.2 44.77,5.05 44.45,5.36 VCA.4
BOOT1
  Top 0.305: R81.1 59.26,45.52 58.7,46.07 F446.60
CALIB_3340A
  Top 0.305: CAL_A.P$1 R6.1 5.78,7.11 6.58,6.31 9.87,6.31 10.54,6.99 18.98,6.99 R8.1
CALIB_3340B  (via drill 0.35)
  Top 0.305: CAL_B.P$1 R5.1 6.04,37.65 6.73,36.96 8.76,36.96 9.53,37.72 v14.86,37.72 | R7.1 19.81,36.83 v19.94,36.7
  Bottom 0.305: v19.94,36.7 18.92,37.72 v14.86,37.72
CALIB_IN_3340A  (via drill 0.35)
  Top 0.305: F446.14 48.43,48.43 v48.13,48.13
  Bottom 0.305: v48.13,48.13 49.66,48.13 50.42,48.89 50.42,56.01 49.4,57.02 48.39,57.02 46.86,58.55 46.86,64.01 49.15,66.29 49.15,69.09 47.5,70.74 CAL_IN_A.P$1
CALIB_IN_3340B  (via drill 0.35)
  Top 0.305: v44.83,51.82 45.21,51.43 47.35,51.43 47.93,50.85 F446.15
  Bottom 0.305: v44.83,51.82 44.83,53.21 45.09,53.47 48.13,53.47 48.64,53.97 48.64,54.99 45.85,57.78 45.85,65.66 CAL_IN_B.P$1
CAP1_VCF
  Top 0.406: VCF1.5 C43.2
CAP2_VCF
  Top 0.406: VCF1.4 C45.2
CAP3_VCF
  Top 0.406: C49.2 VCF1.16
CAP4_VCF
  Top 0.406: VCF1.11 C52.2
CV_CUTOFF
  Top 0.305: CV_TM.E 95.34,19.39 CUTOFF.P$1
CV_FREQ_3340A
  Bottom 0.305: CV_A.P$1 7.62,35.94 5.29,33.61 5.29,27.01 HIGH_A.E
CV_FREQ_3340B
  Bottom 0.305: CV_B.P$1 5.46,57.58 HIGH_B.E
CV_PWM_3340A
  Top 0.305: 3340A.5 20.83,17.04 23.37,14.5 R3.1 23.47,13.78 24.68,12.56 24.68,9.41 R4.1
CV_PWM_3340B
  Top 0.305: 3340B.5 20.83,47.78 23.37,45.24 R1.1 23.47,44.51 24.68,43.29 24.68,40.15 R2.1
CV_RES
  Top 0.305: Q_TM.E 81.41,19.56 Q_TM.S 81.41,22.48 Q.P$1
CV_VCA
  Top 0.305: R58.1 36.01,5.78 VCA_CV.P$1
EXT1
  Top 0.254: F446.50 60.5,41.07 61.57,40 61.57,35.02 EXT.1
EXT2
  Top 0.254: EXT.2 60.58,31.54 63.98,34.94 63.98,38.98 61.38,41.57 F446.51
EXT3
  Top 0.254: EXT.3 63.12,32.64 64.38,33.9 64.38,39.4 61.71,42.07 F446.52
EXT4
  Top 0.254: F446.53 62.16,42.57 64.79,39.95 64.79,33.89 65.66,33.02 EXT.4
FEEDBACK_VCF
  Top 0.305: C44.1 84.9,55.65 86.7,53.85 ADG453.15 ADG453.2
FMLIN_3340B
  Top 0.305: FM_B.P$1 12.89,65.73 C11.2
FREQ_CTRL_3340A
  Top 0.305: 3340A.15 12.83,25.65 R24.1 12.83,28.23 11.94,27.35 LOW_A.A | LOW_A.A 8.09,26.72 HIGH_A.S 5.59,21.72 HIGH_A.A | LOW_A.S 5.59,27.35 LOW_A.A
FREQ_CTRL_3340B
  Top 0.305: 3340B.15 12.83,56.39 R23.1 12.83,58.97 11.94,58.08 LOW_B.A | LOW_B.A 8.09,57.45 HIGH_B.S 5.59,52.45 HIGH_B.A | LOW_B.S 5.59,58.08 LOW_B.A
FREQ_CV_VCF
  Bottom 0.305: VCF1.12 89.03,31.62 88.39,30.99 88.39,24.89 91.23,22.06 CV_TM.S
GAIN1_A
  Bottom 0.305: GAINS.8 24.26,75.56 28.75,80.05 2164A.3
GAIN1_B
  Bottom 0.305: GAINS.4 34.42,73.16 40.12,78.87 55.09,78.87 57.39,81.17 57.53,81.31 2164B.3
GAIN2_A
  Bottom 0.305: GAINS.5 31.88,74.2 36.37,78.69 2164A.6
GAIN2_B
  Bottom 0.305: GAINS.1 46.86,75.82 58.68,75.82 62.67,79.81 63.05,79.81 65.15,81.92 2164B.6
GAIN3_A  (via drill 0.35)
  Top 0.254: 36.2,88.52 v32.39,84.71
  Top 0.305: 2164A.11 36.37,88.69 36.2,88.52
  Bottom 0.254: v32.39,84.71 32.39,80.73 32.73,80.39 32.73,76.42
  Bottom 0.305: GAINS.6 29.34,73.03 32.73,76.42
GAIN3_B
  Bottom 0.305: GAINS.2 39.5,74.8 41.02,76.33 58.55,76.33 61.34,79.12 61.34,86.49 62.36,87.5 64.39,87.5 65.15,88.27 2164B.11
GAIN4_A  (via drill 0.35)
  Bottom 0.305: GAINS.7 26.8,75.56 29.84,78.61 29.84,84.2 v28.57,85.47 28.57,89.46 2164A.14
GAIN4_B
  Bottom 0.305: GAINS.3 36.96,75.06 38.73,76.84 57.53,76.84 58.8,78.11 58.8,86.23 57.53,87.5 2164B.14
GND  (via drill 0.35)
  Top 0.254: AD5644.3 35.18,50.16 35.43,49.91 37.08,49.91 38.86,49.91 39.75,49.02 | F446.18 44.38,47.57 42.93,49.02 39.75,49.02 | 39.75,49.02 39.75,48.39 | 37.21,52.2 38.26,53.25 GREEN.C | 14.61,70.09 12.14,70.09 C16.2
  Top 0.305: C43.1 C45.1 77.92,39.34 79.3,40.73 81.01,40.73 82.07,41.78 VCF1.3 85.09,41.78 v86.87,40 | C52.1 95.97,29.08 | 95.97,29.08 97.28,30.39 97.28,33.11 96.23,34.16 C40.2 C39.1 96.14,36.7 v96.77,37.34 | 95.97,29.08 96.77,28.29 96.77,24.77 96.01,24 92.58,24 90.3,21.72 90.3,17.1 CV_TM.A | C49.1 v96.39,41.78 | R68.1 v80.9,53.21 | F446.63 59,47.57 59.64,48.21 C70.1 61.77,48.21 v65.28,44.7 66.93,44.7 68.33,46.1 24C04.7 | RST.3 RST.4 | F446.12 49.43,52.16 48.24,53.36 C68.1 47.37,53.38 47.37,54.36 v46.86,54.86 | C55.1 50.88,54.65 51.56,55.33 51.56,61.49 53.14,63.07 v58.24,63.07 C71.1 | 40.26,45.07 40.26,42 40.91,41.35 C60.1 41.95,41.07 F446.31 44.65,41.07 44.43,40.85 44.43,38.67 43.74,37.99 C67.1 43.74,34.09 42.86,33.21 RED2.C | 24C04.4 73.41,43.94 74.32,44.85 74.32,56.75 MIDI.3 | R81.2 62.43,43.62 65.79,40.26 24C04.1 | C7.1 23.27,62.04 22.48,61.25 22.48,58.27 20.83,56.62 3340B.12 | C7.1 24,66.33 22.71,67.62 C14.2 23.11,69.15 23.11,75.06 | v19.54,53.97 15.49,53.97 | 15.49,53.97 14.99,53.97 14.48,54.48 14.48,58.42 14.35,58.55 14.35,60.96 15.43,62.04 R18.2 15.75,62.86 14.99,63.63 11.43,63.63 10.29,62.48 C12.1 | C7.1 C9.1 | v21.84,39.5 R2.2 23.31,39.37 R13.1 23.17,36.82 C15.2 24,33.21 C8.1 | v15.75,38.48 15.31,38.92 C5.1 C1.1 12.63,38.8 12.32,38.48 8.06,38.48 R5.2 | 19.66,20.96 19.66,23.5 20.83,24.66 3340A.12 20.83,25.88 22.48,27.53 22.48,30.51 23.27,31.3 C8.1 | 19.66,20.96 19.66,16.12 21.9,13.88 21.9,10.4 23.43,8.86 R4.2 | 19.66,20.96 17.27,20.96 14.48,23.75 14.48,27.69 14.35,27.81 14.35,30.23 15.43,31.3 R19.2 15.75,32.13 14.99,32.89 11.43,32.89 10.29,31.75 C13.1
  Top 0.305: C8.1 C10.1 28.55,31.3 32.83,35.59 C59.- 34.52,35.59 33.4,36.7 v33.4,38.73 | v17.02,7.75 15.75,7.75 15.31,8.19 C6.1 C2.1 12.63,8.92 11.59,7.87 R6.2 | v21.84,8.76 R4.2 | R66.1 97.85,64.39 | 97.85,64.39 97.85,64.74 96.63,65.96 90.5,65.96 89.79,66.68 86.23,66.68 | 85.22,64.9 83.95,64.9 83.82,64.77 82.74,64.77 C51.2 82.36,64.39 80.9,64.39 | 85.22,64.9 85.72,64.9 87.18,63.44 R72.2 | 86.23,66.68 85.22,65.66 85.22,64.9 | ADG453.5 95.25,57.66 95.88,57.02 97.16,57.02 97.92,57.78 97.92,64.32 97.85,64.39 | v40.26,29.34 41.28,30.35 C61.1 45.72,31.24 46.48,32 49.28,32 50.93,30.35 RED1.C 53.28,30.29 | v40.77,20.96 41.28,20.96 41.65,21.33 BH2221.20 | SW1.1 55.17,28.4 53.28,30.29 | 53.28,30.29 52.25,31.31 C66.1 54.43,37.7 F446.47 | v42.04,56.01 C72.1 40.13,55.75 GREEN.C | C32.1 C31.1 35.94,92.58 37.47,91.06 37.47,85.73 | 37.47,85.73 37.47,80.65 36.2,79.38 C30.1 35.27,79.72 32.73,79.72 v31.88,78.87 | 37.47,85.73 39.75,85.73 40.7,84.78 41.4,84.78 | C25.1 58.29,78.8 60.07,77.02 62.87,77.02 64.64,78.8 C26.1 66.42,80.07 66.42,83.69 67.25,84.52 67.94,84.52 | 67.94,84.52 66.42,86.05 66.42,91.38 C27.1 C28.1 56.96,92.65 56.39,92.08 v56.39,91.57 | C34.2 74.99,85.62 73.8,84.44 73.3,84.44 | 73.3,84.44 71.38,82.53 70.23,82.53 2164B.8 | 67.94,84.52 68.03,84.44 73.3,84.44 | C33.1 41.4,84.78 | C37.2 52.31,3.43 51.21,4.54 48.09,4.54 47.03,3.48 R52.2 46.99,3.47 VCA.6 46.99,8.38 45.85,9.52 40.26,9.52 39.24,10.54 39.24,12.95 v38.1,14.1 37.34,14.86 C74.1 | R4.2 R27.1 | R56.2 R61.1 12.13,93.12 9.91,90.89 MODRING.13 9.91,88.77 8.76,87.63 4.95,87.63 4.95,83.06 15.62,83.06 16.51,82.17 SUB.9 16.51,78.11 v16,77.6
  Top 0.305: SUB.4 11.43,71.44 C16.2 | v16,77.6 15.24,76.84 SUB.7 15.24,70.73 14.61,70.09 | SUB.12 v12.7,78.87 | 23.11,75.06 22.22,75.06 21.72,75.56 18.03,75.56 v16,77.6 | 23.11,75.06 28.56,75.06 30.06,76.56 v30.06,77.09 30.06,77.85 29.11,78.8 C29.1 | v80.9,63.63 80.9,64.39 | 80.9,64.39 80.9,71.5 79.63,72.77 ITOV.3 | 67.31,60.32 67.31,56.02 C65.- | 2164A.8 41.45,84.73 41.4,84.78 | 37.21,52.2 37.08,52.07 37.08,49.91 | v15.49,53.34 15.49,53.97 | 0V/5V/-15V/+15V.1 88.27,88.52 86.49,88.52 86.11,88.14 86.11,84.33 86.99,83.44 5V.C 87.88,83.38 v87.88,80.65 | 92.84,80.65 89.28,80.65 | 89.28,80.65 89.03,80.65 | 92.84,80.65 94.14,81.95 -15V.A | +15V.C 95.66,80.65 92.84,80.65 | 39.75,48.39 39.75,45.58 40.26,45.07 | C69.1 40.59,45.07 40.26,45.07 | 89.28,80.65 89.28,69.72 86.23,66.68
  Top 0.406: TLV75533.2 67.69,60.71 67.31,60.32 | 0V/5V/-15V/+15V.2 0V/5V/-15V/+15V.1 | C65.- 70.99,55.57 | v87.88,80.65 89.03,80.65 | 70.99,55.57 71.83,55.57 MIDI.3 | 3V3.C 71.53,55.03 70.99,55.57
  Bottom 0.254: 77.22,43.05 76.45,42.29 76.45,38.61
  Bottom 0.305: v96.39,41.78 96.77,41.4 96.77,38.99 | 96.77,38.99 v96.77,37.34 95.25,35.82 C86.1 | 96.77,38.99 95.76,37.97 88.9,37.97 v86.87,40 | VCF1.3 81.79,41.78 80.52,43.05 | 80.52,43.05 80.52,52.07 80.9,52.45 v80.9,53.21 80.9,57.02 | v80.9,63.63 80.9,57.02 | SW2.2 SW2.1 SW1.2 SW1.1 | v65.28,44.7 65.79,44.2 24C04.1 65.79,36.2 | v15.75,38.48 20.83,38.48 v21.84,39.5 21.84,44.67 19.66,46.85 19.66,50.27 20.58,51.18 C87.1 20.58,52.93 v19.54,53.97 19.54,54.1 20.83,55.4 3340B.12 | v21.84,8.76 20.83,7.75 v17.02,7.75 | 40.32,21.4 40.26,21.46 v40.26,29.34 33.4,36.2 v33.4,38.73 33.4,44.83 34.16,45.59 34.16,46.35 34.48,46.67 | 40.32,21.4 v40.77,20.96 | C64.2 63.11,19.56 65.53,17.14 71.6,17.14 72.36,16.38 C73.- | C56.1 55.74,63.07 v58.24,63.07 58.24,65.61 59.18,66.55 61.31,66.55 C62.- | 34.48,46.67 42.04,54.23 v42.04,56.01 42.29,56.26 42.42,56.26 | JACK.1 98.68,12.25 98.68,9.27 | CV_TM.A 92.31,17.06 93.55,15.82 | 14.73,78.87 v12.7,78.87 | 14.73,78.87 v16,77.6 | v31.88,78.87 31.88,77.85 31.11,77.09 v30.06,77.09 | 76.83,79.38 72.16,79.38 70.23,81.31 2164B.8 | 76.83,79.38 78.36,77.85 78.36,73.53 | ITOV.3 77.6,72.77 78.36,73.53 | v38.1,14.1 37.08,15.11 37.08,18.16 40.32,21.4 | 80.52,43.05 77.22,43.05 | MIDI.3 80.52,57.4 80.9,57.02 | C76.1 34.48,46.67 | C77.1 14.86,78.99 14.73,78.87 | C78.1 v15.49,53.34 | C75.1 69.21,9.4 | 69.21,9.4 C79.1 | C80.1 76.45,38.61 74.04,38.61 24C04.4 73.41,37.59 72.01,36.2 68.2,36.2 | C81.1 78.36,70.74 78.36,73.53 | C82.1 v56.39,91.56 v56.39,91.57 | C83.1 20.07,21.46 | 20.07,21.46 C84.1 | 3340A.12 20.83,23.37 20.07,22.61 20.07,21.46 | C85.1 76.83,79.38 | SW2.2 74.93,28.17 74.93,16.38 73.66,15.11 C73.-
  Bottom 0.305: C73.- 68.86,15.11 67.76,14.01 67.76,10.85 69.21,9.4 | 68.2,36.2 65.79,36.2 | 65.79,36.2 65.15,36.2 64.58,35.62 STLINK.5 | 68.2,36.2 68.33,36.07 I2C.3 72.21,30.28 SW2.2 | 42.42,56.26 39.53,59.15 39.53,63.11 39.89,63.47 RST.4 | C88.1 44.33,84.89 2164A.8 | v46.86,54.86 43.82,54.86 42.42,56.26 | C57.1 52.74,63.47 RST.3
  Bottom 0.406: C53.- C54.+ C58.- 87.5,80.26 v87.88,80.65 | C63.2 70.33,22.76 70.33,26.29 SW2.2 | 93.55,15.82 97.94,15.82 98.74,15.02 JACK.1 | R75.1 96.82,8.51 97.92,8.51 98.68,9.27
  Bottom 0.61: C57.1 C56.1
  pour Bottom (isolate 0.305): 0.13,98.93 101.73,98.93 101.73,-0.13 0.13,-0.13
  pour Top (isolate 0.305): 0.13,98.93 101.73,98.93 101.73,-0.13 0.13,-0.13
HEADIN_OPAMP_OUT  (via drill 0.35)
  Top 0.305: SUM_CON.5 SUM_OPAMP.2 65.66,9.02 66.93,7.75 76.33,7.75 v78.04,6.04
  Bottom 0.305: R69.2 C46.2 v78.04,6.04 | SUM_CON.4 SUM_CON.6 SUM_CON.8 SUM_CON.7 SUM_CON.5 SUM_CON.3 SUM_CON.1 SUM_CON.2
IN1_MIXERA
  Top 0.305: C18.1 A1.P$1
IN1_VCF
  Top 0.305: R59.2 R62.2
  Top 0.406: VCF1.1 82.07,46.86 81.18,47.75 R59.2
IN2_MIXERA
  Top 0.305: C20.1 A2.P$1
IN2_MIXERB
  Top 0.305: C17.1 B2.P$1
IN2_VCF
  Top 0.305: R65.2 84.9,45.93 83.29,44.32 VCF1.2 81.37,44.32 79.82,42.77 R64.1 77.7,40.55 77.4,40.55 76.96,40.12 76.96,35.21 77.92,34.26 R67.1
IN3_MIXERA
  Top 0.305: A3.P$1 C23.1
IN3_MIXERB
  Top 0.305: C21.1 B3.P$1
IN3_VCF
  Top 0.305: R71.2 R74.1 89.98,49.08 88.14,47.24 88.14,45.21 89.03,44.32 VCF1.17
  Top 0.406: R70.1 VCF1.17
IN4_MIXERB
  Top 0.305: B4.P$1 C22.1
IN4_MIXERB1
  Top 0.305: C19.1 B1.P$1
IN4_VCF
  Top 0.305: R77.2 93.16,47.4 94.54,46.02 96.21,46.02 97.41,44.82 97.41,40.68 95.97,39.24 R76.1 95.06,38.54 94.49,37.97 88.9,37.97 87.88,36.96 87.88,29.08 89.12,27.85 93.68,27.85 95.06,26.47 R78.1
  Top 0.406: R77.2 90.93,47.5 VCF1.18
IN_VCF
  Top 0.305: C41.2 78.1,50.48 VCF_IN.P$1
IN_VCFORDER
  Top 0.305: R68.2 87.15,53.21 87.78,52.58 ADG453.16 ADG453.1
IOUT_VCA  (via drill 0.35)
  Top 0.305: VCA.5 45.72,8.13 v45.85,8.25
  Bottom 0.305: v45.85,8.25 51.94,8.25 VCA_OUT.P$1
ITOV_IN
  Top 0.305: R46.1 77.41,90.3 R47.1 77.66,88.62 79.69,86.59 R48.1 C35.1 79.69,76.9 78.1,75.31 ITOV.2 | I_SUM.1 I_SUM.3 I_SUM.5 I_SUM.7 I_SUM.9 I_SUM.11 I_SUM.13 I_SUM.15
  Bottom 0.406: I_SUM.15 72.01,70.48 ITOV.2
LED1_PWM  (via drill 0.35)
  Top 0.305: F446.22 44.09,45.57 v43.94,45.72 | v41.4,49.66 42.42,50.67 R90.1
  Bottom 0.305: v43.94,45.72 38.99,45.72 37.97,46.74 37.97,49.02 38.61,49.66 v41.4,49.66
LED2_PWM
  Top 0.305: F446.38 49.93,35.89 R89.1
LED3_PWM  (via drill 0.35)
  Top 0.305: F446.26 46.72,43.57 v46.99,43.31 | v43.32,39.67 42.57,38.92 R91.1
  Bottom 0.305: v46.99,43.31 43.35,39.67 v43.32,39.67
LINEAR_CTRL_3340A
  Top 0.305: 3340A.13 R26.1 R22.1
LINEAR_CTRL_3340B
  Top 0.305: R25.1 3340B.13 | R21.1 18.19,65.73 17.11,64.65 17.11,60.71 17.68,60.14 R25.1 | R20.1 R25.1
N$1  (via drill 0.35)
  Top 0.254: v62.36,78.36 60.07,80.65
  Top 0.305: 60.07,80.65 2164B.4
  Bottom 0.254: I_SUM.10 62.36,73.28 v62.36,78.36
N$2
  Top 0.305: 3340B.6 23.37,47.78 23.37,47.33 26.19,44.51 C3.2
N$3
  Top 0.305: SUB.10 15.24,81.66 14.61,82.3 10.79,82.3 10.16,81.66 SUB.14
N$4
  Top 0.254: I_SUM.2 49.91,73.03 49.15,73.79 35.69,73.79 31.11,78.36
  Top 0.305: 2164A.4 31.29,80.94 30.99,80.65 30.99,78.49 31.11,78.36
N$5
  Bottom 0.305: SW2.4 73.53,22.33 73.53,18.42 73.02,17.91 69.47,17.91 68.96,18.42 R85.1 R82.2 65.53,19.56 64.77,20.32 64.77,22.71 SW2.3
N$6
  Top 0.305: A4.P$1 C24.1
N$7
  Top 0.305: SW1.3 SW1.4
  Bottom 0.305: SW1.3 55.17,20.14 55.75,19.56 R83.2 R86.1
N$8  (via drill 0.35)
  Top 0.305: v25.27,35.18 25.27,36.89 R13.2 26.54,36.96 26.8,37.21 26.8,40.51 26.29,41.02 C3.1
  Bottom 0.305: v25.27,35.18 24.51,34.42 19.18,34.42 SYNC_B.P$1
N$9
  Top 0.305: SD4.2 95.73,58.29 95.1,58.93 ADG453.6
N$10
  Top 0.305: C25.2 R32.2
N$11
  Top 0.305: R28.2 C19.2
N$12
  Top 0.305: MODRING.14 8.64,92.04 7.56,93.12 R56.1 R53.2
N$13
  Top 0.305: C36.2 35.18,12 R49.2
N$14
  Top 0.305: R46.2 IN9.P$1
N$15
  Top 0.305: R47.2 IN10.P$1
N$16
  Top 0.305: SD4.1 95.73,60.83 95.1,60.2 ADG453.7
N$17
  Top 0.305: VCA.1 39.12,7.68 R58.2
N$18
  Top 0.305: SD3.1 86.87,58.93 ADG453.11
N$20
  Top 0.305: R37.2 C26.2
N$22
  Top 0.305: R38.2 C27.2
N$23
  Top 0.254: BH2221.4 51.37,23.28 54.48,20.17 A010/9/8/7/3/4/5/6.7
N$24
  Top 0.305: C28.2 R39.2
N$34
  Top 0.254: AD5644.1 36.18,52.94 37.97,54.74 37.97,62.86 36.45,64.39 ABCD.1
N$35
  Top 0.254: ABCD.2 35.94,61.85 37.11,60.68 37.11,55.33 35.68,53.9 AD5644.2
N$36
  Top 0.305: SD3.2 84.96,63.02 86.56,61.42 86.56,60.5 86.87,60.2 ADG453.10
N$37
  Top 0.305: R72.1 89.35,65.34 IN34.1 88.22,61.8 ADG453.9
N$38
  Top 0.305: R45.2 21.48,84.81 23.67,82.62 2164A.1
N$39
  Top 0.254: AD5644.4 34.68,54.24 36.45,56.01 36.45,58.29 35.43,59.31 ABCD.3
N$40
  Top 0.254: AD5644.5 34.18,56.53 ABCD.4
N$41
  Top 0.305: SUB.2 8.89,75.66 10.28,77.06 13.46,77.06 13.97,76.54 SUB.6
N$42  (via drill 0.35)
  Top 0.254: SUB.5 12.57,74.52 v12.57,76.45
  Top 0.305: SUB.5 12.7,71.44 C16.1 | SUB.11 13.97,78.36 13.59,77.98 v13.34,77.98 8.51,77.98 7.62,78.87 SUB.16
  Bottom 0.254: v12.57,76.45 13.34,77.22 v13.34,77.98
N$43
  Top 0.305: R53.1 2.48,90.93 C38.1
N$44
  Top 0.305: R63.2 17.3,88.83 15.9,90.23 MODRING.9
N$45  (via drill 0.35)
  Top 0.254: C42.1 9.46,94.8 v9.27,94.62 | v5.97,92.46 6.1,92.33 MODRING.16
  Top 0.305: R60.1 C42.1
  Bottom 0.254: v9.27,94.62 6.6,94.62 5.97,93.98 v5.97,92.46
N$46
  Top 0.305: C42.2 R57.1
N$47
  Top 0.305: C36.1 37.82,10.1 39.5,8.42 41.72,8.42 43.18,6.96 VCA.3 43.18,3.74 R50.1
N$48
  Top 0.305: R89.2 50.93,32.96 RED1.A
N$49
  Top 0.305: XMOD.P$1 15.84,97.32 3.18,97.32 2.48,96.62 R57.2
N$50
  Top 0.305: XIN.P$1 3.17,87.7 C38.2
N$51
  Top 0.305: R61.2 14.03,91.34 13.72,91.03 MODRING.10 13.72,88.18 13.2,87.66 11.94,87.66 11.18,88.43 MODRING.12
N$52
  Top 0.305: R91.2 RED2.A
N$53
  Top 0.305: R92.2 87.7,85.79 88.9,84.58 89.53,84.58 89.6,84.52 5V.A
N$54
  Top 0.305: -15V.C 92.04,83.91 93.91,85.79 R93.2
N$55
  Top 0.305: R94.2 98.23,85.66 96.77,84.2 96.52,84.2 96.36,84.04 +15V.A
N$56
  Top 0.305: R90.2 41.97,53.15 41.15,52.32 41.15,51.43 40.86,51.15 GREEN.A
N$57
  Top 0.406: R95.2 3V3.A
N$58  (via drill 0.35)
  Top 0.254: F446.16 45.61,50.02 44.07,51.56 44.07,56.9 v43.56,57.4
  Bottom 0.254: v43.56,57.4 43.69,57.53 44.32,57.53 45.09,58.29 45.09,64.9 43.43,66.55 ANAIN.2
N$59  (via drill 0.35)
  Top 0.254: v40.13,62.86 38.35,64.64 ANAIN.1 | v42.42,57.4 43.49,56.33 43.49,50.7 45.48,48.71 F446.17
  Bottom 0.254: v40.13,62.86 40.13,59.69 v42.42,57.4
N$65
  Top 0.305: R30.2 C21.2
N$69
  Top 0.305: C17.2 R29.2
N$70
  Top 0.305: C22.2 R31.2
N$74
  Top 0.305: R41.2 C30.2
N$75
  Top 0.305: R40.2 C29.2
N$76
  Top 0.305: C31.2 R42.2
N$77
  Top 0.305: C32.2 R43.2
N$78
  Top 0.305: R33.2 C18.2
N$79
  Top 0.305: C23.2 R35.2
N$80
  Top 0.305: R34.2 C20.2
N$81
  Top 0.305: C24.2 R36.2
N$104
  Top 0.254: R80.2 55.69,54.12
  Top 0.406: 55.69,54.12 Q1.1
  Bottom 0.406: Q1.1 C56.2
N$108
  Top 0.61: TLV75533.5 63.77,59.76 R87.2
N$109
  Top 0.813: R87.1 L1.1
N$116
  Top 0.305: C41.1 79.82,49.75 77.92,47.85 R59.1
N$171
  Top 0.305: C12.2 10.57,60.14 12.47,62.04 R23.2
N$172
  Top 0.305: C14.1 21.34,65.47 21.34,64.07 20.83,63.56 R20.2
N$173
  Bottom 0.305: 3340B.1 10.67,44.15 TEMCOB.A
N$174
  Top 0.305: TEMCOB.E 8.51,46.57 10.57,44.51 R11.1
  Bottom 0.305: TEMCOB.E 5.59,46.57 TEMCOB.S
N$175
  Top 0.305: C11.1 R21.2
N$176
  Top 0.305: 3340B.8 R14.2
N$301
  Top 0.305: C13.2 10.57,29.4 12.47,31.3 R24.2
N$302
  Top 0.305: C15.1 20.83,33.59 R22.2
N$303
  Bottom 0.305: 3340A.1 10.67,13.41 TEMCOA.A
N$304
  Top 0.305: TEMCOA.E 8.51,15.83 10.57,13.78 R12.1
  Bottom 0.305: TEMCOA.E 5.59,15.83 TEMCOA.S
N$306
  Top 0.305: 3340A.8 R15.2
N$307
  Top 0.305: 3340A.6 23.37,17.04 26.16,14.25 C4.2
NRST
  Top 0.305: RST.1 48.84,58.95 | 48.84,58.95 47.3,57.41 R79.2 48.32,56.39 49.02,55.69 49.02,53.5 49.77,52.75 C55.2 51.39,52.75 51.94,52.2 51.93,52.18 F446.7 | RST.2 48.84,58.95
  Bottom 0.305: RST.1 54.18,54.38 54.18,37.04 57.17,34.05 58.7,34.05 STLINK.3
OSC_IN
  Top 0.305: R80.1 53.74,52.98 52.93,52.17 F446.5
OSC_OUT
  Top 0.254: Q1.2 52.44,56.82
  Top 0.305: 52.44,56.82 52.43,56.81 F446.6
  Bottom 0.406: Q1.2 C57.2
OUT1_VCF
  Top 0.305: R62.1 R64.2 76.96,42.67 76.33,42.04 76.33,32.26 76.96,31.62 VCF1.7
OUT2_VCF  (via drill 0.35)
  Top 0.305: R67.2 VCF1.6 v88.27,39.75 | R70.2 v96.65,44.32 | ADG453.3 94.87,55.12 97.41,52.58 v97.41,49.15
  Bottom 0.305: v96.65,44.32 97.41,45.09 v97.41,49.15 96.18,49.15 93.91,46.88 93.91,42.6 91.82,40.51 89.03,40.51 v88.27,39.75
OUT3_VCF
  Top 0.305: VCF1.15 89.69,39.24 87.12,41.81 87.12,48.13 88.08,49.09 R74.2
  Top 0.406: R76.2 VCF1.15
OUT4_VCF  (via drill 0.35)
  Top 0.305: VCF1.10 86.49,26.54 85.6,27.43 85.6,35.81 v86.87,37.08 | v86.61,55.12 ADG453.14
  Top 0.406: R78.2 91.19,25.65 VCF1.10
  Bottom 0.305: v86.87,37.08 86.87,38.14 86.27,38.74 86.27,41.62 86.23,41.66 86.23,54.74 v86.61,55.12
OUT_JACK
  Bottom 0.305: C50.- 87.82,5.4 92.32,5.4 96.89,9.97 JACK.3 JACK.2
OUT_MIXER
  Top 0.305: R48.2 C35.2 81.59,78.32
  Top 0.406: 81.59,78.32 81.59,74.11 82.93,72.77 ITOV.6
  Bottom 0.305: MIXOUT.P$1 ITOV.6
OUT_OPAMP
  Bottom 0.305: R69.1 C46.1 79.82,7.87 78.36,7.87 77.98,8.25 77.6,8.25 | 77.6,8.25 74.8,8.25 SUM_OPAMP.6 | 77.6,8.25 79.19,9.84 R73.2
OUT_POT
  Bottom 0.305: R73.1 84.71,11.05 C50.+ 87.76,9.02 89.03,7.75 R75.2 R75.3
OUT_VCF
  Top 0.305: C44.2 83,58.99 82.42,59.56 VCF_OUT.P$1 75.44,56.9 75.44,54.74 75.44,30.61 76.96,29.08 R55.2
PULSE_3340A
  Top 0.305: 3340A.4 18.29,14.5 19.46,13.33 SQU_A.P$1 19.81,13.08 19.81,10.12 | R8.2 19.81,10.12 | 19.81,10.12
PULSE_3340B
  Top 0.305: 3340B.4 18.29,45.24 19.46,44.07 SQU_B.P$1 19.81,43.81 19.81,40.85 | R7.2 19.81,40.85 | 19.81,40.85
RES_CUR_IN_VCF
  Top 0.406: VCF1.8 R55.1
RES_CUR_VCF
  Top 0.305: VCF1.9 77.6,26.54 76.83,25.78 76.83,19.13 Q_TM.A
SAW_3340A
  Top 0.305: R15.1 28.45,8.25 SAW_A.P$1
SAW_3340B
  Top 0.305: R14.1 28.45,39.75 SAW_B.P$1
SCALE_3340A
  Top 0.305: R19.1 3340A.14
SCALE_3340B
  Top 0.305: R18.1 3340B.14
SCL  (via drill 0.35)
  Top 0.305: 69.47,42.04 v69.98,42.54 | 69.47,42.04 68.96,42.04 65.68,42.04 61.14,46.57 F446.61 | I2C.2 69.6,35.43 69.6,42.04 69.47,42.04
  Bottom 0.305: v69.98,42.54 70.87,43.43 24C04.6 68.07,49.66 R84.1
SDA
  Top 0.305: 70.55,44.01 24C04.5 | I2C.1 72.14,35.43 72.14,42.42 70.55,44.01 | F446.62 61.52,47.07 64.59,44.01 70.55,44.01
  Bottom 0.305: R88.1 73.41,50.04 24C04.5
SOFT_SYNC_3340A
  Top 0.305: C10.2 3340A.9
SOFT_SYNC_3340B
  Top 0.305: C9.2 3340B.9
SUB_IN
  Top 0.305: SUB.3 10.16,73.71 9.08,72.63 4.94,72.63 SUB_IN.P$1
SUB_OUT2  (via drill 0.35)
  Top 0.305: SUB2.P$1 6.58,75.44 SUB.1 7.62,76.58 v8,76.96 | v11.43,78.87 SUB.13
  Bottom 0.305: v8,76.96 9.91,78.87 v11.43,78.87
SUB_OUT4
  Top 0.305: SUB.15 8.89,81.74 8.51,82.12 4.39,82.12 3.17,80.9 SUB4.P$1
SW1  (via drill 0.35)
  Top 0.305: v51.56,40.77 50.93,40.14 F446.40
  Bottom 0.305: v51.56,40.77 51.56,29 54.15,26.42 66.22,26.42 68.96,23.68 R85.2 69.21,21.34 70.99,19.56 C63.1
SW2  (via drill 0.35)
  Top 0.305: v50.42,40.77 50.42,38.63 F446.39
  Bottom 0.305: C64.1 R86.2 59.31,24.38 58.55,25.15 53.85,25.15 50.42,28.58 v50.42,40.77
SWCLK
  Top 0.305: F446.49 59.63,40.57 60.27,39.93 STLINK.4
SWDIO
  Top 0.305: STLINK.2 57.48,38.16 55.59,40.06 54.28,40.06 53.93,39.7 F446.46
SYNC_3340A
  Top 0.305: SYNC_A.P$1 13.75,5.17 24.38,5.17 25.33,6.12 R27.2 25.33,6.32 26.29,7.28 26.29,11.75 C4.1
TEMPCO2_VCOA
  Top 0.305: 3340A.2 R17.1
TEMPCO2_VCOB
  Top 0.305: 3340B.2 R16.1
TIMING_CAP_3340A
  Top 0.305: C8.2 24,25.91 3340A.11
TIMING_CAP_3340B
  Top 0.305: C7.2 24,56.64 3340B.11
TRI_3340A
  Bottom 0.305: TRI_A.P$1 28.19,34.92 25.91,32.64 3340A.10
TRI_3340B
  Bottom 0.305: TRI_B.P$1 26.54,56.64 3340B.10
USART1_RX  (via drill 0.35)
  Top 0.305: F446.59 55.39,45.57 v54.99,45.97
  Bottom 0.305: v54.99,45.97 71.5,62.48 MIDI.1
USART1_TX  (via drill 0.35)
  Top 0.305: F446.58 v58.41,45.07 v58.42,45.09
  Bottom 0.305: v58.42,45.09 73.28,59.94 MIDI.2
VCA_IN
  Top 0.305: R49.1 33.21,11.96 34.42,10.76 VCA_IN.P$1
VCAP1
  Top 0.305: F446.30 43.96,41.57 42.28,43.25 C60.2
VCF_ANASW_IN4
  Top 0.305: ADG453.8 93.21,61.47 93.09,61.58 IN34.2 R66.2
VEE_VCF
  Top 0.305: C40.1 R54.2
  Top 0.406: C40.1 VCF1.13
VEE_VCOA
  Top 0.305: C2.2 10.67,9.34 R12.2 R17.2 13.75,11.88 15.65,13.78 R10.2 3340A.3
VEE_VCOB
  Top 0.305: C1.2 10.67,40.07 R11.2 R16.2 13.75,42.61 15.65,44.51 R9.2 3340B.3

## Text on the board
tNames: SYD.X.REY / INSTR. / 2020